# Altium schematic sheet Nixie_schematics.SchDoc: Nixie Tube
size A2; Organization: Altium Limited
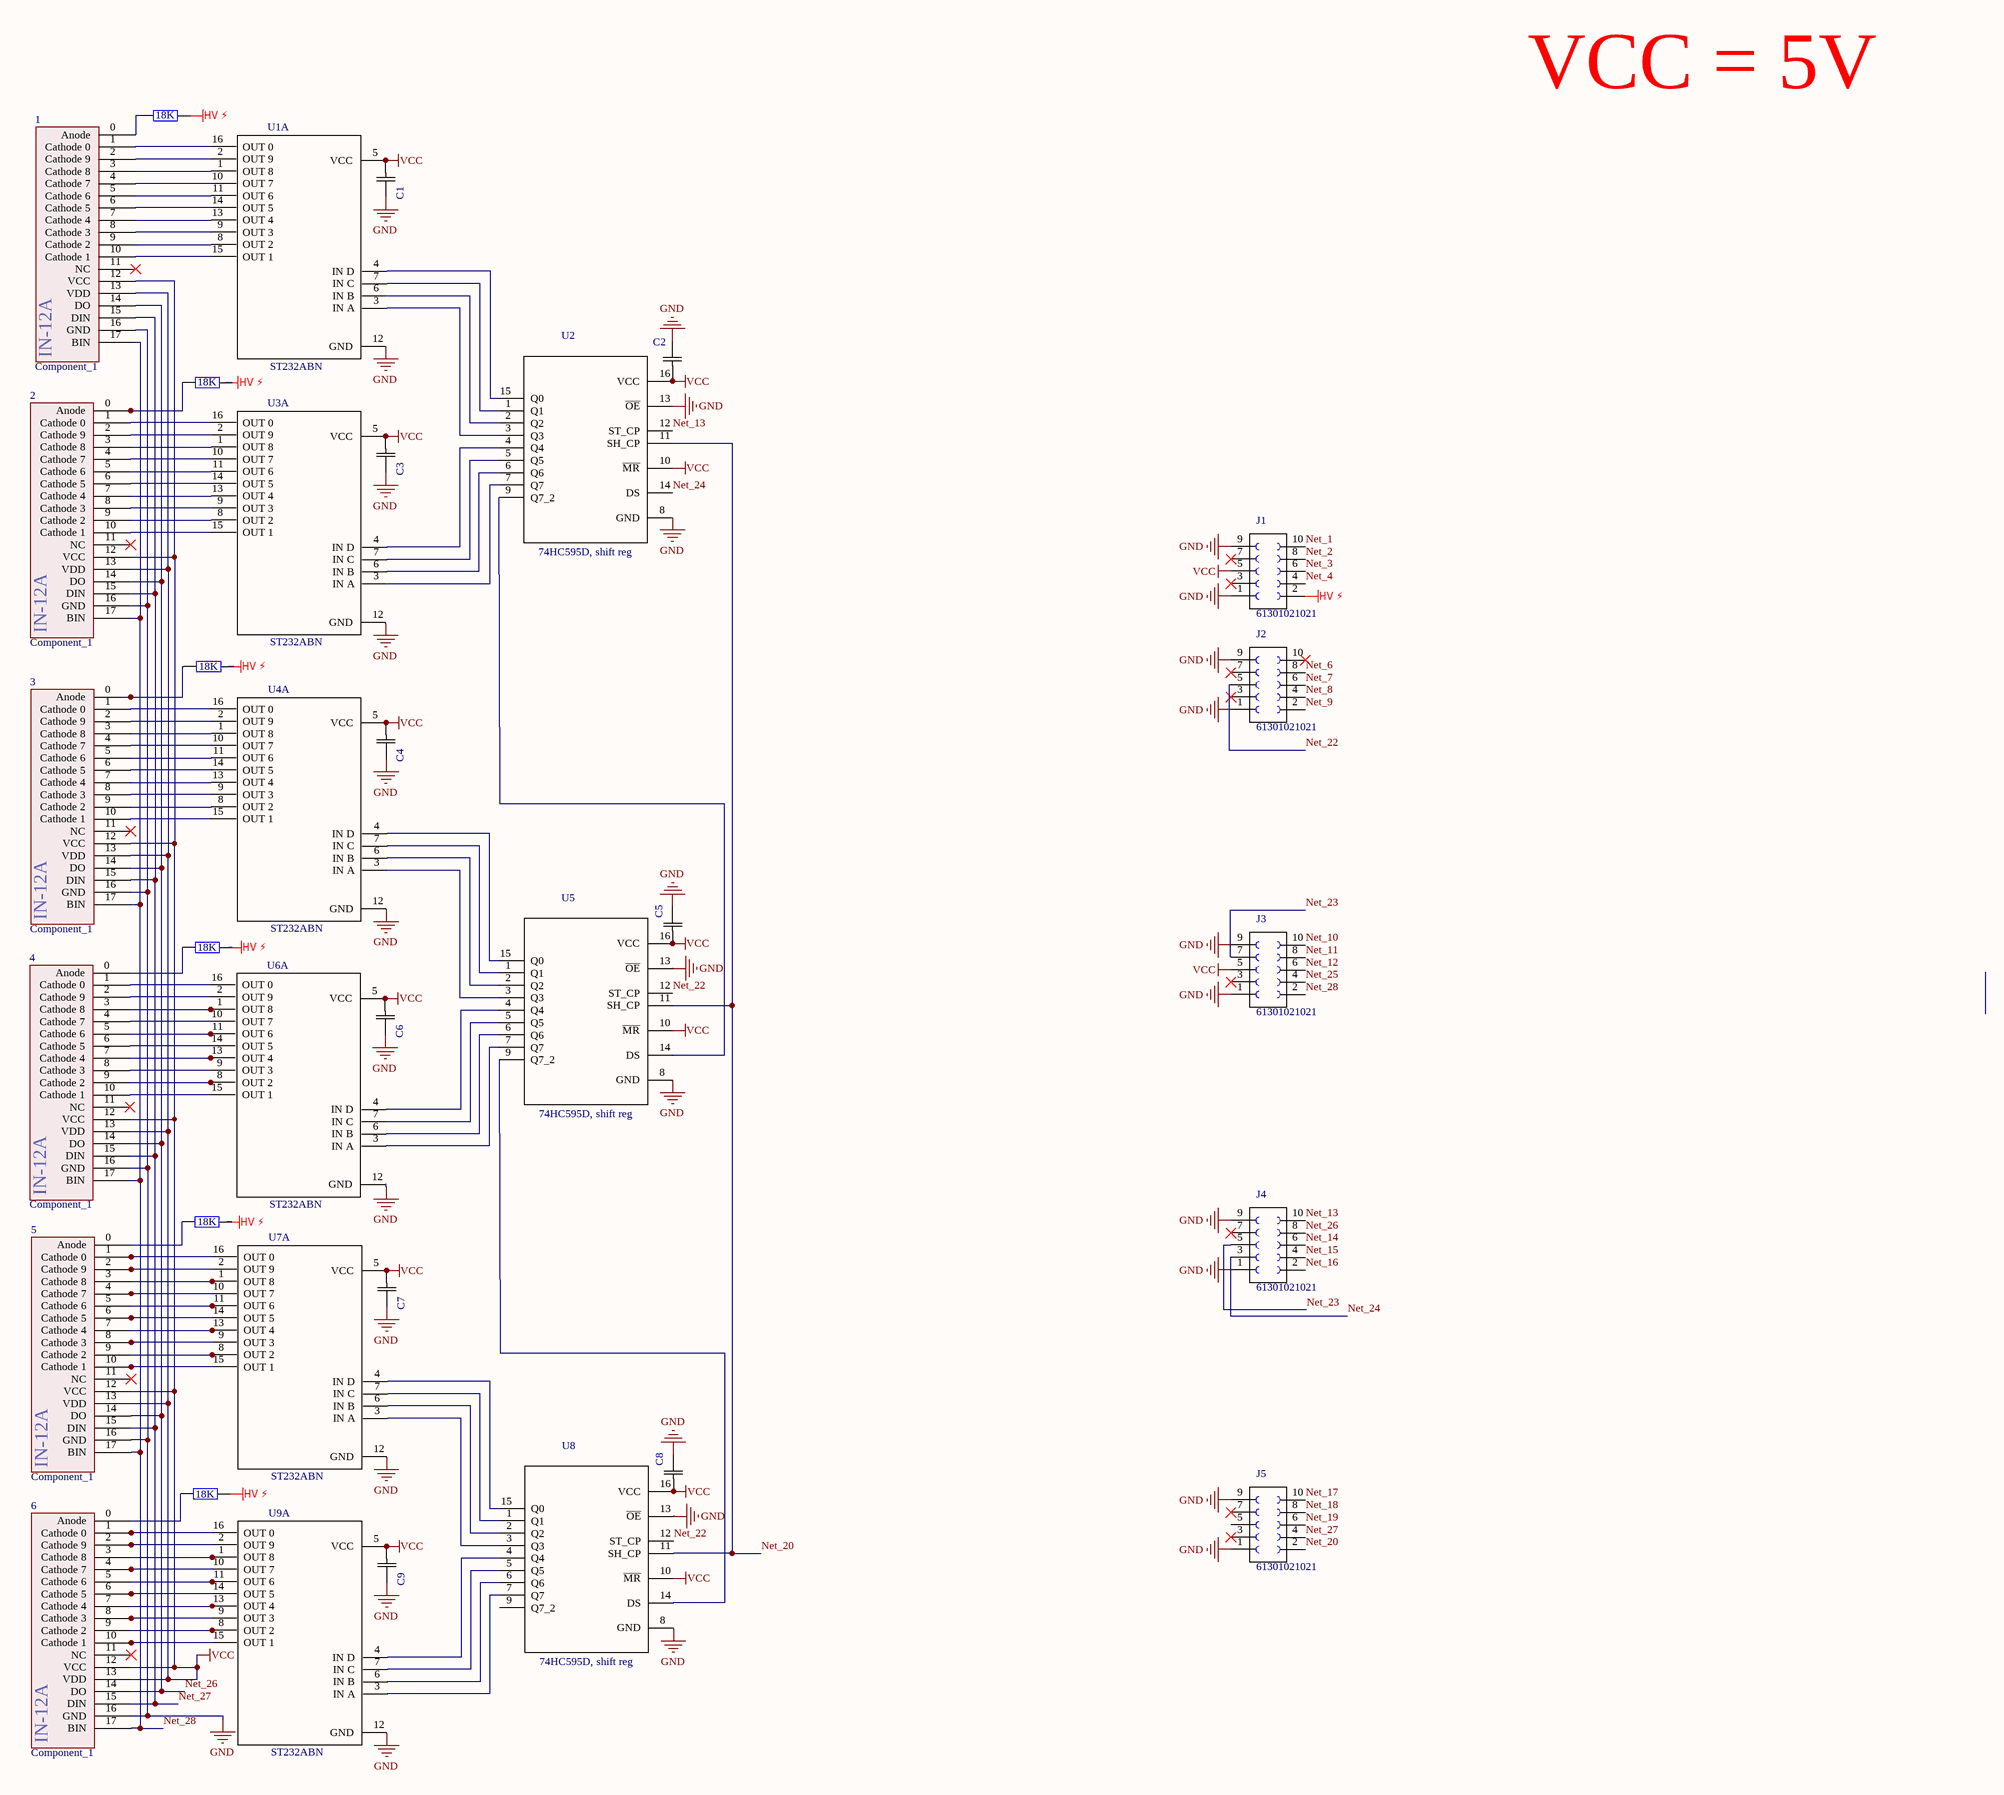
[diagram p0: Nixie_schematics.SchDoc]

## Parts
1  Component_1  [PCBComponent_3]
2  Component_1  [PCBComponent_3]
3  Component_1  [PCBComponent_3]
4  Component_1  [PCBComponent_3]
5  Component_1  [PCBComponent_3]
6  Component_1  [PCBComponent_3]
C1  (no value)  [*CAPC2013X90N]
C2  (no value)  [*CAPC2013X90N]
C3  (no value)  [*CAPC2013X90N]
C4  (no value)  [*CAPC2013X90N]
C5  (no value)  [*CAPC2013X90N]
C6  (no value)  [*CAPC2013X90N]
C7  (no value)  [*CAPC2013X90N]
C8  (no value)  [*CAPC2013X90N]
C9  (no value)  [*CAPC2013X90N]
J1  61301021021  [*61301021821]
J2  61301021021  [*61301021821]
J3  61301021021  [*61301021821]
J4  61301021021  [*61301021821]
J5  61301021021  [*61301021821]
R1  value 18K  [AXIAL-0.4]  (hidden comment: f)
R2  value 18K  [AXIAL-0.4]  (hidden comment: f)
R3  value 18K  [AXIAL-0.4]  (hidden comment: f)
R4  value 18K  [AXIAL-0.4]  (hidden comment: f)
R5  value 18K  [AXIAL-0.4]  (hidden comment: f)
R6  value 18K  [AXIAL-0.4]  (hidden comment: f)
U1  ST232ABN  [*DIP254P762X510-16]  (part A of 4)
U2  74HC595D, shift reg  [*SOIC127P600X175-16N]
U3  ST232ABN  [*DIP254P762X510-16]  (part A of 4)
U4  ST232ABN  [*DIP254P762X510-16]  (part A of 4)
U5  74HC595D, shift reg  [*SOIC127P600X175-16N]
U6  ST232ABN  [*DIP254P762X510-16]  (part A of 4)
U7  ST232ABN  [*DIP254P762X510-16]  (part A of 4)
U8  74HC595D, shift reg  [*SOIC127P600X175-16N]
U9  ST232ABN  [*DIP254P762X510-16]  (part A of 4)

## Nets
GND: 1.16(GND) 2.16(GND) 3.16(GND) 4.16(GND) 5.16(GND) 6.16(GND) C1.2(C2) C2.2(C2) C3.2(C2) C4.2(C2) C5.2(C2) C6.2(C2) C7.2(C2) C8.2(C2) C9.2(C2) J1.1 J1.9 J2.1 J2.9 J3.1 J3.9 J4.1 J4.9 J5.1 J5.9 U1.12(GND) U2.8(GND) U2.13(~{OE}) U3.12(GND) U4.12(GND) U5.8(GND) U5.13(~{OE}) U6.12(GND) U7.12(GND) U8.8(GND) U8.13(~{OE}) U9.12(GND)
HV ⚡: J1.2 R1.2 R2.2 R3.2 R4.2 R5.2 R6.2
VCC: 1.12(VCC) 1.13(VDD) 2.12(VCC) 2.13(VDD) 3.12(VCC) 3.13(VDD) 4.12(VCC) 4.13(VDD) 5.12(VCC) 5.13(VDD) 6.12(VCC) 6.13(VDD) C1.1(C1) C2.1(C1) C3.1(C1) C4.1(C1) C5.1(C1) C6.1(C1) C7.1(C1) C8.1(C1) C9.1(C1) J1.5 J3.5 U1.5(VCC) U2.10(~{MR}) U2.16(VCC) U3.5(VCC) U4.5(VCC) U5.10(~{MR}) U5.16(VCC) U6.5(VCC) U7.5(VCC) U8.10(~{MR}) U8.16(VCC) U9.5(VCC)
Net_1: J1.10
Net_2: J1.8
Net_3: J1.6
Net_4: J1.4
Net_6: J2.8
Net_7: J2.6
Net_8: J2.4
Net_9: J2.2
Net_10: J3.10
Net_11: J3.8
Net_12: J3.6
Net_13: J4.10 U2.12(ST_CP)
Net_14: J4.6
Net_15: J4.4
Net_16: J4.2
Net_17: J5.10
Net_18: J5.8
Net_19: J5.6
Net_20: J5.2 U2.11(SH_CP) U5.11(SH_CP) U8.11(SH_CP)
Net_22: J2.5 U5.12(ST_CP) U8.12(ST_CP)
Net_23: J3.7 J4.5
Net_24: J4.3 U2.14(DS)
Net_25: J3.4
Net_26: 1.14(DO) 2.14(DO) 3.14(DO) 4.14(DO) 5.14(DO) 6.14(DO) J4.8
Net_27: 1.15(DIN) 2.15(DIN) 3.15(DIN) 4.15(DIN) 5.15(DIN) 6.15(DIN) J5.4
Net_28: 1.17(BIN) 2.17(BIN) 3.17(BIN) 4.17(BIN) 5.17(BIN) 6.17(BIN) J3.2
Net1_0: 1.0(Anode) R1.1
Net1_1: 1.1(Cathode_0) U1.16(OUT_0)
Net1_2: 1.2(Cathode_9) U1.2(OUT_9)
Net1_3: 1.3(Cathode_8) U1.1(OUT_8)
Net1_4: 1.4(Cathode_7) U1.10(OUT_7)
Net1_5: 1.5(Cathode_6) U1.11(OUT_6)
Net1_6: 1.6(Cathode_5) U1.14(OUT_5)
Net1_7: 1.7(Cathode_4) U1.13(OUT_4)
Net1_8: 1.8(Cathode_3) U1.9(OUT_3)
Net1_9: 1.9(Cathode_2) U1.8(OUT_2)
Net1_10: 1.10(Cathode_1) U1.15(OUT_1)
Net2_0: 2.0(Anode) R2.1
Net2_1: 2.1(Cathode_0) U3.16(OUT_0)
Net2_2: 2.2(Cathode_9) U3.2(OUT_9)
Net2_3: 2.3(Cathode_8) U3.1(OUT_8)
Net2_4: 2.4(Cathode_7) U3.10(OUT_7)
Net2_5: 2.5(Cathode_6) U3.11(OUT_6)
Net2_6: 2.6(Cathode_5) U3.14(OUT_5)
Net2_7: 2.7(Cathode_4) U3.13(OUT_4)
Net2_8: 2.8(Cathode_3) U3.9(OUT_3)
Net2_9: 2.9(Cathode_2) U3.8(OUT_2)
Net2_10: 2.10(Cathode_1) U3.15(OUT_1)
Net3_0: 3.0(Anode) R3.1
Net3_1: 3.1(Cathode_0) U4.16(OUT_0)
Net3_2: 3.2(Cathode_9) U4.2(OUT_9)
Net3_3: 3.3(Cathode_8) U4.1(OUT_8)
Net3_4: 3.4(Cathode_7) U4.10(OUT_7)
Net3_5: 3.5(Cathode_6) U4.11(OUT_6)
Net3_6: 3.6(Cathode_5) U4.14(OUT_5)
Net3_7: 3.7(Cathode_4) U4.13(OUT_4)
Net3_8: 3.8(Cathode_3) U4.9(OUT_3)
Net3_9: 3.9(Cathode_2) U4.8(OUT_2)
Net3_10: 3.10(Cathode_1) U4.15(OUT_1)
Net4_0: 4.0(Anode) R4.1
Net4_1: 4.1(Cathode_0) U6.16(OUT_0)
Net4_2: 4.2(Cathode_9) U6.2(OUT_9)
Net4_3: 4.3(Cathode_8) U6.1(OUT_8)
Net4_4: 4.4(Cathode_7) U6.10(OUT_7)
Net4_5: 4.5(Cathode_6) U6.11(OUT_6)
Net4_6: 4.6(Cathode_5) U6.14(OUT_5)
Net4_7: 4.7(Cathode_4) U6.13(OUT_4)
Net4_8: 4.8(Cathode_3) U6.9(OUT_3)
Net4_9: 4.9(Cathode_2) U6.8(OUT_2)
Net4_10: 4.10(Cathode_1) U6.15(OUT_1)
Net5_0: 5.0(Anode) R5.1
Net5_1: 5.1(Cathode_0) U7.16(OUT_0)
Net5_2: 5.2(Cathode_9) U7.2(OUT_9)
Net5_3: 5.3(Cathode_8) U7.1(OUT_8)
Net5_4: 5.4(Cathode_7) U7.10(OUT_7)
Net5_5: 5.5(Cathode_6) U7.11(OUT_6)
Net5_6: 5.6(Cathode_5) U7.14(OUT_5)
Net5_7: 5.7(Cathode_4) U7.13(OUT_4)
Net5_8: 5.8(Cathode_3) U7.9(OUT_3)
Net5_9: 5.9(Cathode_2) U7.8(OUT_2)
Net5_10: 5.10(Cathode_1) U7.15(OUT_1)
Net6_0: 6.0(Anode) R6.1
Net6_1: 6.1(Cathode_0) U9.16(OUT_0)
Net6_2: 6.2(Cathode_9) U9.2(OUT_9)
Net6_3: 6.3(Cathode_8) U9.1(OUT_8)
Net6_4: 6.4(Cathode_7) U9.10(OUT_7)
Net6_5: 6.5(Cathode_6) U9.11(OUT_6)
Net6_6: 6.6(Cathode_5) U9.14(OUT_5)
Net6_7: 6.7(Cathode_4) U9.13(OUT_4)
Net6_8: 6.8(Cathode_3) U9.9(OUT_3)
Net6_9: 6.9(Cathode_2) U9.8(OUT_2)
Net6_10: 6.10(Cathode_1) U9.15(OUT_1)
NetU1_3: U1.3(IN_A) U2.3(Q3)
NetU1_4: U1.4(IN_D) U2.15(Q0)
NetU1_6: U1.6(IN_B) U2.2(Q2)
NetU1_7: U1.7(IN_C) U2.1(Q1)
NetU2_4: U2.4(Q4) U3.4(IN_D)
NetU2_5: U2.5(Q5) U3.7(IN_C)
NetU2_6: U2.6(Q6) U3.6(IN_B)
NetU2_7: U2.7(Q7) U3.3(IN_A)
NetU2_9: U2.9(Q7_2) U5.14(DS)
NetU4_3: U4.3(IN_A) U5.3(Q3)
NetU4_4: U4.4(IN_D) U5.15(Q0)
NetU4_6: U4.6(IN_B) U5.2(Q2)
NetU4_7: U4.7(IN_C) U5.1(Q1)
NetU5_4: U5.4(Q4) U6.4(IN_D)
NetU5_5: U5.5(Q5) U6.7(IN_C)
NetU5_6: U5.6(Q6) U6.6(IN_B)
NetU5_7: U5.7(Q7) U6.3(IN_A)
NetU5_9: U5.9(Q7_2) U8.14(DS)
NetU7_3: U7.3(IN_A) U8.3(Q3)
NetU7_4: U7.4(IN_D) U8.15(Q0)
NetU7_6: U7.6(IN_B) U8.2(Q2)
NetU7_7: U7.7(IN_C) U8.1(Q1)
NetU8_4: U8.4(Q4) U9.4(IN_D)
NetU8_5: U8.5(Q5) U9.7(IN_C)
NetU8_6: U8.6(Q6) U9.6(IN_B)
NetU8_7: U8.7(Q7) U9.3(IN_A)

Not connected (* = marked no-connect by the designer): 1 11(NC)*; 2 11(NC)*; 3 11(NC)*; 4 11(NC)*; 5 11(NC)*; 6 11(NC)*; J1 3(4)* 7(2)*; J2 3(4)* 7(2)* 10*; J3 3(4)*; J4 7(2)*; J5 3(4)* 5(3) 7(2)*; U8 9(Q7_2)

## Notes on the sheet
- VCC = 5V
- Title
- Size:
- Date:
- File:
- A2
- Number:
- Time:
- Revision:
- Sheet
- of
- (in symbol Component_1) IN-12A

## Library data of the parts
C1-C9 = U0805R104KCT: Capacitor, 0805, 100nf, 50v; MF: Multicomp; SnapEDA_Link: https://www.snapeda.com/parts/U0805R104KCT/Multicomp/view-part/?ref=snap; MP: U0805R104KCT; Availability: Unavailable; Price: None; Package: 0805 Multicomp; Value: *
J1-J5 = 61301021021: 2.54mm Pitch 10 Way 2 Row Right Angle Pin Header, Through Hole, Solder Pin Term; MF: Wurth Electronics; SnapEDA_Link: https://www.snapeda.com/parts/61301021021/Wurth%20Electronics%20Inc./view-part/?ref=snap; Price: None; MP: 61301021021; Availability: Unavailable; Package: None; Value: *
R1-R6 = Res2: Resistor; Published: 8-Jun-2000; LatestRevisionDate: 17-Jul-2002; LatestRevisionNote: Re-released for DXP Platform.; PackageReference: AXIAL-0.4; Publisher: Altium Limited; PackageDescription: Axial Device, Thru-Hole; 2 Leads; 0.4 in Pin Spacing
U1 U3 U4 U6 U7 U9 = ST232ABN: Ic Drvr/Rcvr 5v Rs232 16-Dip
U2 U5 U8 = 74HC595D-Q100,118: 74HC_T_595-Q100 - 8-bit serial-in, serial or parallel-out shift register with output latches; 3-state